# EAGLE schematic NDS-JOYSTICK (EAGLE 6.4)
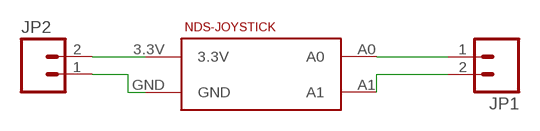
[diagram p0: schematic, sheet 1]

## Parts
JP1  M02LOCK  [1X02_LOCK]
JP2  M02LOCK  [1X02_LOCK]
U$1  NDS-JOYSTICK  [NDS-JOYSTICK]

## Nets
3.3V: JP2.2 U$1.3.3V
A0: JP1.1 U$1.A0
A1: JP1.2 U$1.A1
GND: JP2.1 U$1.GND

## Library data of the parts
JP1 JP2 = SparkFun:M02: Header 2 Standard 2-pin 0.1" header. Use with straight break away headers (SKU : PRT-00116), right angle break away headers (PRT-00553), swiss pins (PRT-00743), machine pins (PRT-00117), and female headers (PRT-00115). Molex polarized connector foot print use with SKU : PRT-08233 with associated crimp pins and housings.
U$1 = Random parts:NDS-JOYSTICK